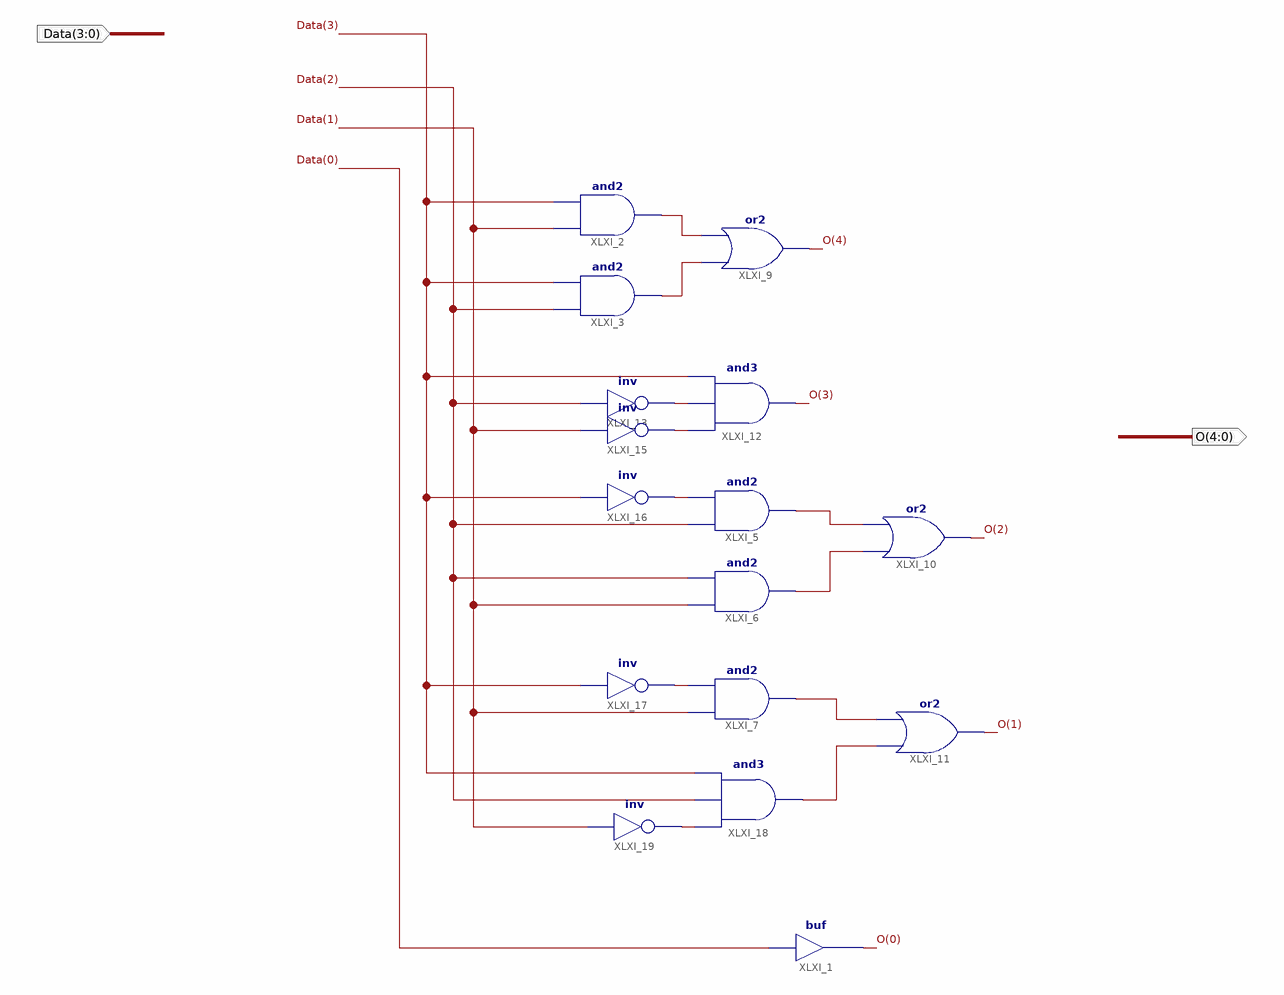
[diagram p0: schematic sheet 1]
// Xilinx ISE schematic BCD_4Bit.sch (spartan6) as structural Verilog: 16 symbols, 2 ports
module BCD_4Bit (
  input  [3:0] Data,
  output [4:0] O
);

  wire XLXN_11, XLXN_12, XLXN_13, XLXN_14, XLXN_15, XLXN_31, XLXN_32, XLXN_33, XLXN_34, XLXN_35, XLXN_36;

  buf XLXI_1 (O[0], Data[0]);
  and XLXI_2 (XLXN_31, Data[1], Data[3]);
  and XLXI_3 (XLXN_32, Data[2], Data[3]);
  and XLXI_5 (XLXN_33, Data[2], XLXN_13);
  and XLXI_6 (XLXN_34, Data[1], Data[2]);
  and XLXI_7 (XLXN_35, Data[1], XLXN_14);
  or XLXI_9 (O[4], XLXN_32, XLXN_31);
  or XLXI_10 (O[2], XLXN_34, XLXN_33);
  or XLXI_11 (O[1], XLXN_36, XLXN_35);
  and XLXI_12 (O[3], XLXN_12, XLXN_11, Data[3]);
  not XLXI_13 (XLXN_11, Data[2]);
  not XLXI_15 (XLXN_12, Data[1]);
  not XLXI_16 (XLXN_13, Data[3]);
  not XLXI_17 (XLXN_14, Data[3]);
  and XLXI_18 (XLXN_36, XLXN_15, Data[2], Data[3]);
  not XLXI_19 (XLXN_15, Data[1]);
endmodule
